# EAGLE design ZwiftCommand (EAGLE 9.3.0)
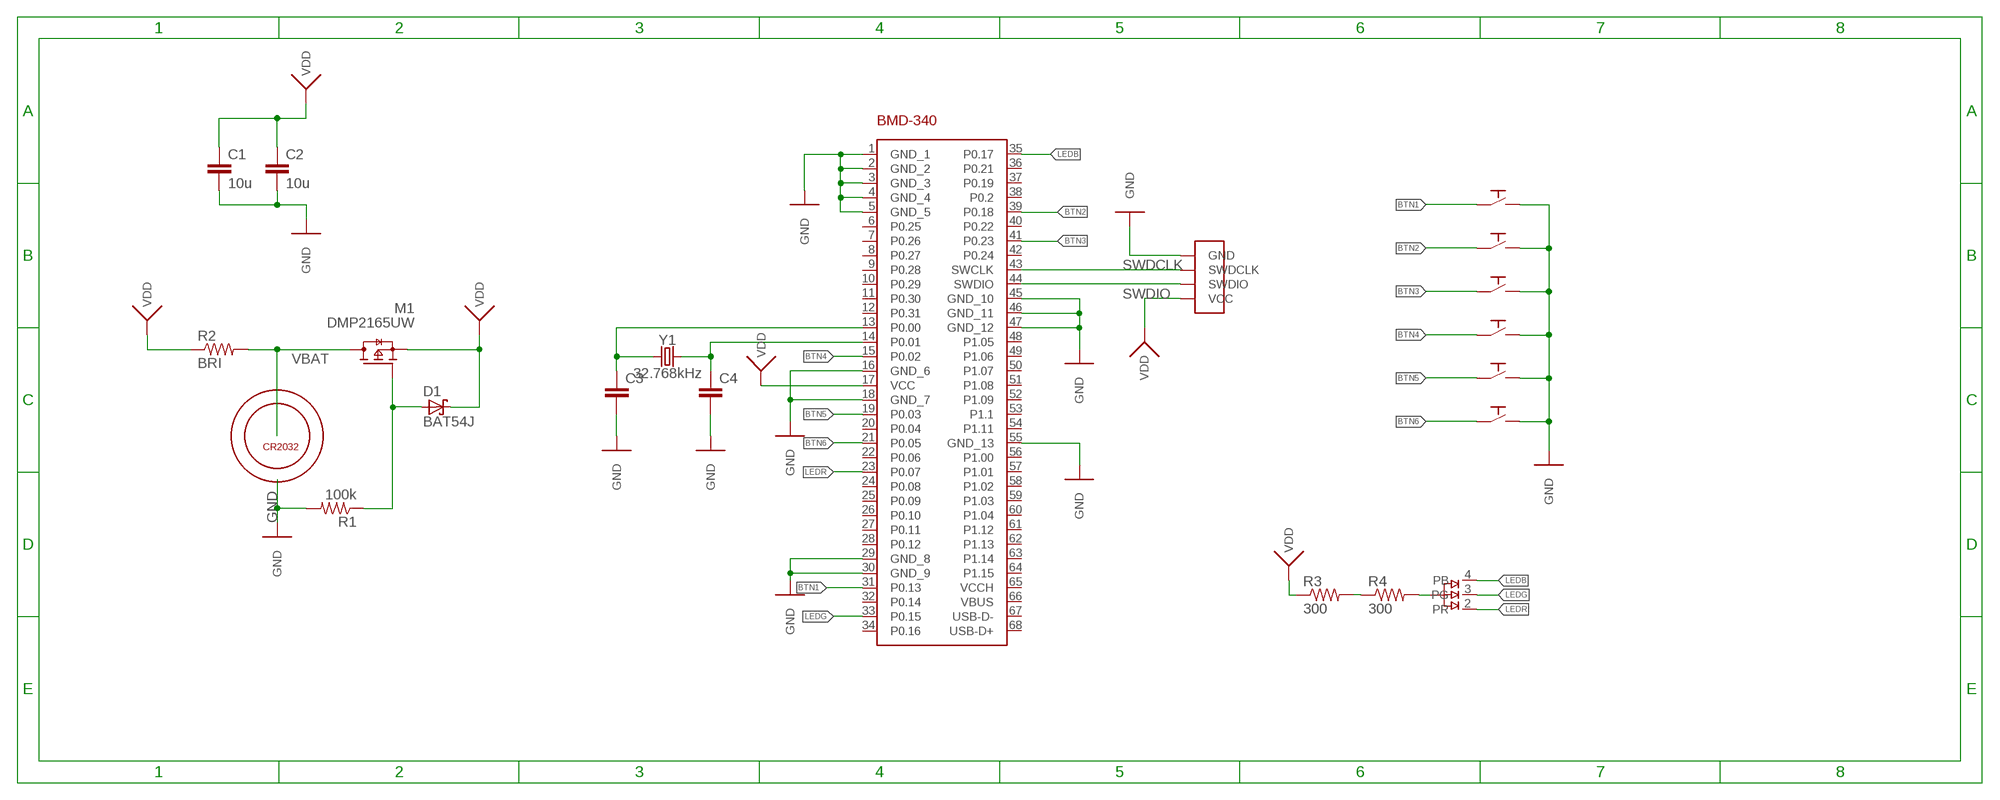
[diagram p0: schematic, sheet 1]

## Parts
C1  10u  C-EUC0603  [C0603]
C2  10u  C-EUC0603  [C0603]
C3  C-EUC0603  [C0603]
C4  C-EUC0603  [C0603]
D1  BAT54J  [SOD323(F)]
D2  LRTBR48G  [LRTBR48GP9Q71R7S526NP68]
IC1  BMD-340-A-R  [BMD340AR]
M1  DMP2165UW  [SOT65P210X110-3N]
R1  100k  R-US_R0603  [R0603]
R2  BRI  R-US_R0402  [R0402]
R3  300  R-US_R0603  [R0603]
R4  300  R-US_R0603  [R0603]
SPST1  PTS526SK08  [PTS526SKG15SMTR2LFS]
SPST2  PTS526SK08  [PTS526SKG15SMTR2LFS]
SPST3  PTS526SK08  [PTS526SKG15SMTR2LFS]
SPST4  PTS526SK08  [PTS526SKG15SMTR2LFS]
SPST5  PTS526SK08  [PTS526SKG15SMTR2LFS]
SPST6  PTS526SK08  [PTS526SKG15SMTR2LFS]
U1  BAT-HLD-001-THM  [BATHLD001THM]
U$2  PROG_SMD  [PROG_SMD]
Y1  32.768kHz  CRYSTAL-32.768KHZSMD-3.2X1.5  [CRYSTAL-SMD-3.2X1.5MM]

## Nets
BTN1: IC1.31(P0.13) SPST1.1 SPST1.2
BTN2: IC1.39(P0.18) SPST2.1 SPST2.2
BTN3: IC1.41(P0.23) SPST3.1 SPST3.2
BTN4: IC1.15(P0.02) SPST4.1 SPST4.2
BTN5: IC1.19(P0.03) SPST5.1 SPST5.2
BTN6: IC1.21(P0.05) SPST6.1 SPST6.2
GND: C1.2 C2.2 C3.2 C4.2 IC1.1(GND_1) IC1.2(GND_2) IC1.3(GND_3) IC1.4(GND_4) IC1.5(GND_5) IC1.16(GND_6) IC1.18(GND_7) IC1.29(GND_8) IC1.30(GND_9) IC1.45(GND_10) IC1.46(GND_11) IC1.47(GND_12) IC1.55(GND_13) R1.2 SPST1.3 SPST1.4 SPST2.3 SPST2.4 SPST3.3 SPST3.4 SPST4.3 SPST4.4 SPST5.3 SPST5.4 SPST6.3 SPST6.4 U1.5(-) U$2.GND
LEDB: D2.4(PB) IC1.35(P0.17)
LEDG: D2.3(PG) IC1.33(P0.15)
LEDR: D2.2(PR) IC1.23(P0.07)
N$1: C3.1 IC1.13(P0.00) Y1.P$1
N$2: D1.2(A) M1.1(G) R1.1
N$3: R3.2 R4.1
N$4: C4.1 IC1.14(P0.01) Y1.P$2
N$5: D2.1 R4.2
SWDCLK: IC1.43(SWCLK) U$2.PIN1(SWDCLK)
SWDIO: IC1.44(SWDIO) U$2.PIN2(SWDIO)
VBAT [power]: M1.3(D) R2.2 U1.1(+) U1.2(+) U1.3(+) U1.4(+)
VDD [power]: C1.1 C2.1 D1.1(K) IC1.17(VCC) M1.2(S) R2.1 R3.1 U$2.VCC
Unconnected: IC1.6(P0.25) IC1.7(P0.26) IC1.8(P0.27) IC1.9(P0.28) IC1.10(P0.29) IC1.11(P0.30) IC1.12(P0.31) IC1.20(P0.04) IC1.22(P0.06) IC1.24(P0.08) IC1.25(P0.09) IC1.26(P0.10) IC1.27(P0.11) IC1.28(P0.12) IC1.32(P0.14) IC1.34(P0.16) IC1.36(P0.21) IC1.37(P0.19) IC1.38(P0.2) IC1.40(P0.22) IC1.42(P0.24) IC1.48(P1.05) IC1.49(P1.06) IC1.50(P1.07) IC1.51(P1.08) IC1.52(P1.09) IC1.53(P1.1) IC1.54(P1.11) IC1.56(P1.00) IC1.57(P1.01) IC1.58(P1.02) IC1.59(P1.03) IC1.60(P1.04) IC1.61(P1.12) IC1.62(P1.13) IC1.63(P1.14) IC1.64(P1.15) IC1.65(VCCH) IC1.66(VBUS) IC1.67(USB-D-) IC1.68(USB-D+)

## Library data of the parts
C1-C4 = resistor:C-EU: CAPACITOR, European symbol
D1 = Diodes:BAT54: Schottky barrier diode Planar Schottky barrier diode encapsulated in small plastic SMD packages. Single diodes and double diodes with different pinning are available AAL Eindhoven MK
D2 = KPA_LED:LRTBR48G: RGB LED in a single package
IC1 = Rigado:BMD-340-A-R: Bluetooth Modules (802.15.1) BMD-340-A-R with nRF52840 processor Source: Datasheet <https://componentsearchengine.com/Datasheets/1/BMD-340-A-R.pdf>; DESCRIPTION: Bluetooth Modules (802.15.1) BMD-340-A-R with nRF52840 processor; HEIGHT: 4mm; MANUFACTURER_NAME: Rigado; MANUFACTURER_PART_NUMBER: BMD-340-A-R; MOUSER_PART_NUMBER: 377-BMD-340-A-R
M1 = MOSFET:DMP2165UW: This MOSFET is designed to minimize the on-state resistance (RDS(ON)) and yet maintain superior switching performance, making it ideal for high efficiency power management applications.
R1-R4 = resistor:R-US_: RESISTOR, American symbol
SPST1-SPST6 = SPST:PTS526SK08: Interrupteurs de contact 50mA 12VDC, 5.2x5.2mm, 0.8mm H, 260gf, G leads, No ground pin, no actuator; MTN: 611-PTS526SK08SMTR2L
U1 = BatteryHolder:BAT-HLD-001-THM: Coin Cell Battery Holders Bat Hld CR2032/2025 Through-hole Mount Source: Datasheet <https://componentsearchengine.com/Datasheets/1/BAT-HLD-001-THM.pdf>; DESCRIPTION: Coin Cell Battery Holders Bat Hld CR2032/2025 Through-hole Mount; HEIGHT: 4.2mm; MANUFACTURER_NAME: Linx Technologies; MANUFACTURER_PART_NUMBER: BAT-HLD-001-THM; MOUSER_PART_NUMBER: 712-BAT-HLD-001-THM; MOUSER_PRICE-STOCK: https://www.mouser.com/Search/Refine.aspx?Keyword=712-BAT-HLD-001-THM
U$2 = Prog:PROG_SMD
Y1 = SparkFun-Clocks:CRYSTAL-32.768KHZ: 32.768kHz Crystal Frequency: 32.768kHz Frequency Stability: ±20ppm Load Capacitance: 12.5pF (PTH-2X6 & SMD-3.2X1.5), 6pF (SMD-2X6) SparkFun Products: SparkFun BigTime Watch Kit <https://www.sparkfun.com/products/11734> SparkFun nRF52832 Breakout <https://www.sparkfun.com/products/13990> SparkFun Real Time Clock Module <https://www.sparkfun.com/products/12708>; PROD_ID: XTAL-13062

## Net classes
0 default: width 0.152 mm, drill 0.178 mm, clearance 0.178 mm
1 power: width 0.305 mm, drill 0.178 mm, clearance 0.254 mm

## Board
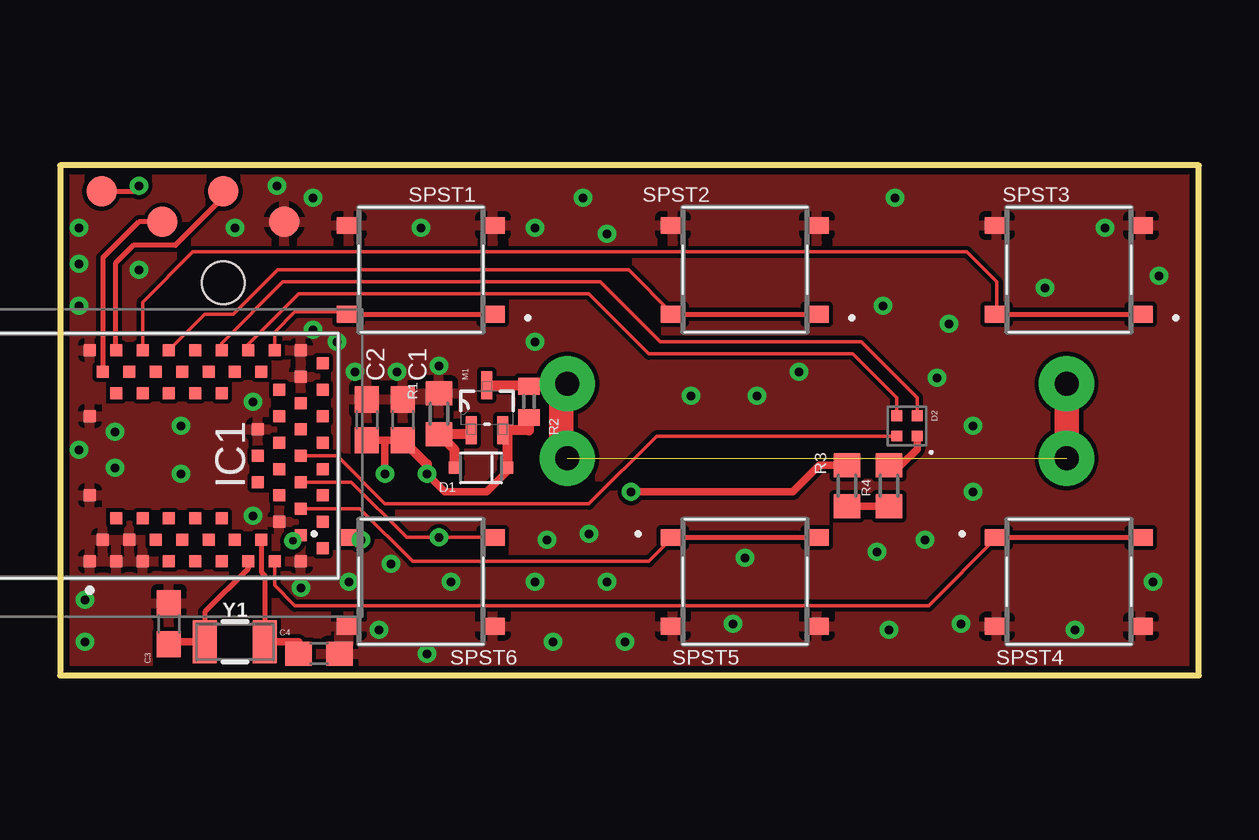
[diagram p1: board, top side]
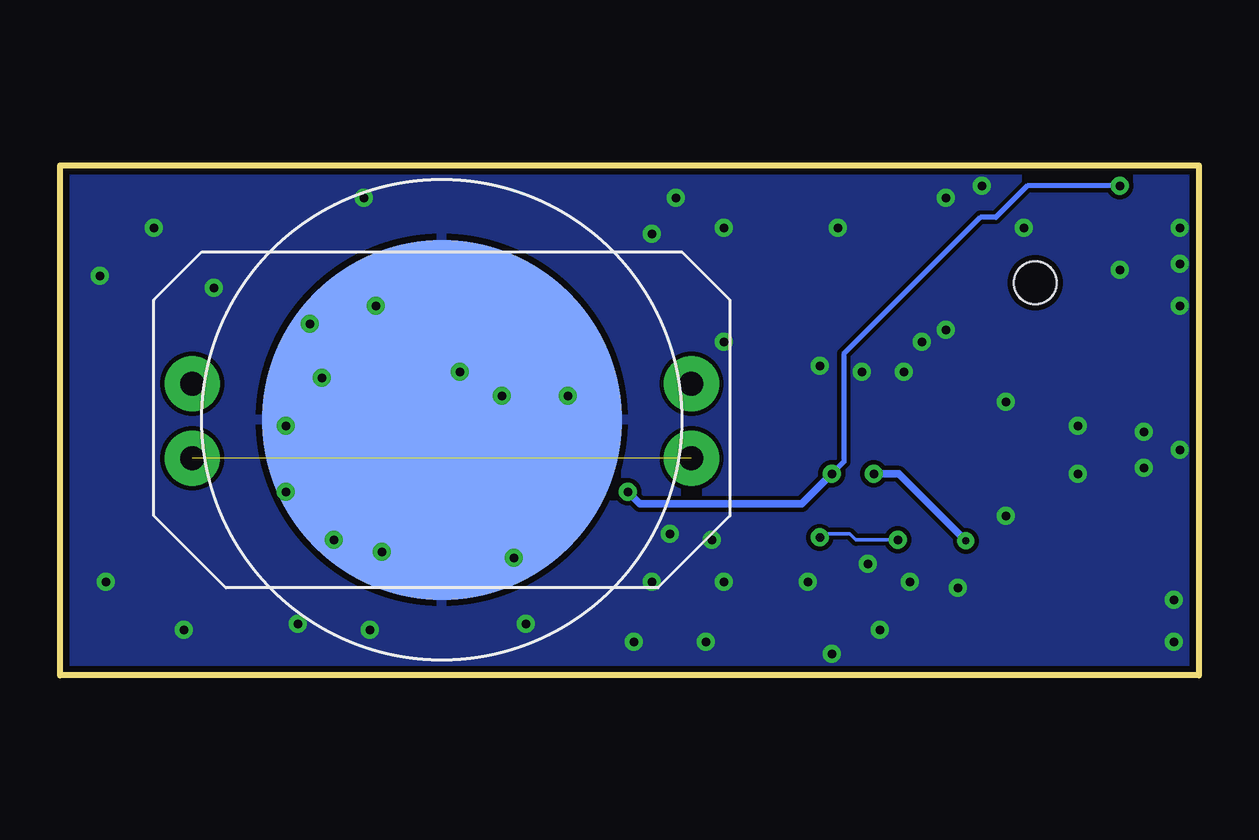
[diagram p2: board, bottom side, seen from below]

Size 47.45 x 21.25 mm. Coordinates in mm from the lower left corner, seen from the top.
Outline: 0,0 47.45,0 47.45,21.25 0,21.25 0,0
Copper layers (1*16): Top 0.035mm / dielectric 1.5mm / Bottom 0.035mm
Design rules "default *": minimum track width 6mil, minimum drill 0.35mm, track to track 6mil, track to pad 6mil, pad to pad 6mil, via to via 6mil, smd to smd 6mil, copper to edge 10mil, drill to drill 6mil, minimum pad ring 10mil, minimum via ring 8mil, stop-mask expansion 4mil, vias tented up to drill 0mil, thermal gap 10mil

### Footprints (pad centres in the part's own frame; a part is rotated, then mirrored left to right if it is on the bottom)
C0603 = smd 1.1 x 1: 1 -0.85,0; 2 0.85,0
SOD323(F) = smd 0.5 x 0.5: 1 1.1,0; 2 -1.1,0
LRTBR48GP9Q71R7S526NP68 = smd 0.45 x 0.45: 1 0.425,0.425; 2 0.425,-0.425; 3 -0.425,-0.425; 4 -0.425,0.425
BMD340AR = smd 0.5 x 0.5: 1 -8.8,-4.4; 2 -8.25,-3.5; 3 -7.7,-4.4; 4 -7.15,-3.5; 5 -6.6,-4.4; 6 -6.05,-3.5; 7 -5.5,-4.4; 8 -4.95,-3.5; 9 -4.4,-4.4; 10 -3.85,-3.5; 11 -3.3,-4.4; 12 -2.75,-3.5; 13 -2.2,-4.4; 14 -1.65,-3.5; 15 -1.1,-4.4; 16 0,-4.4; 17 0,-3.3; 18 -0.9,-2.75; 19 0,-2.2; 20 -0.9,-1.65; 21 0,-1.1; 22 -0.9,-0.55; 23 0,0; 24 -0.9,0.55; 25 0,1.1; 26 -0.9,1.65; 27 0,2.2; 28 -0.9,2.75; 29 0,3.3; 30 0,4.4; 31 -1.1,4.4; 32 -1.65,3.5; 33 -2.2,4.4; 34 -2.75,3.5; 35 -3.3,4.4; 36 -3.85,3.5; 37 -4.4,4.4; 38 -4.95,3.5; 39 -5.5,4.4; 40 -6.05,3.5; 41 -6.6,4.4; 42 -7.15,3.5; 43 -7.7,4.4; 44 -8.25,3.5; 45 -8.8,4.4; 46 -8.8,1.65; 47 -8.8,-1.65; 48 -7.7,-2.6; 49 -6.6,-2.6; 50 -5.5,-2.6; 51 -4.4,-2.6; 52 -3.3,-2.6; 53 -1.8,-1.1; 54 -1.8,0; 55 -1.8,1.1; 56 -3.3,2.6; 57 -4.4,2.6; 58 -5.5,2.6; 59 -6.6,2.6; 60 -7.7,2.6; 61 0.9,-3.85; 62 0.9,-2.75; 63 0.9,-1.65; 64 0.9,-0.55; 65 0.9,0.55; 66 0.9,1.65; 67 0.9,2.75; 68 0.9,3.85
SOT65P210X110-3N = smd 1.168 x 0.457: 1 -0.94,0.65; 2 -0.94,-0.65; 3 0.94,0
R0603 = smd 1 x 1.1: 1 -0.85,0; 2 0.85,0
R0402 = smd 0.7 x 0.9: 1 -0.65,0; 2 0.65,0
PTS526SKG15SMTR2LFS = smd 1 x 0.7: 1 -3,1.85; 2 3,1.85; 3 -3,-1.85; 4 3,-1.85
BATHLD001THM = drill 1 pad 2.3: 1 -10.4,1.5; 2 -10.4,-1.6; 3 10.4,-1.6; 4 10.4,1.5 | smd 15 x 15: 5 0,0
PROG_SMD = smd 1.27 x 1.27: GND 3.81,0; PIN1 1.27,1.27; PIN2 -1.27,0; VCC -3.81,1.27 | hole 1.778: 1.27,-2.54
CRYSTAL-SMD-3.2X1.5MM = smd 1 x 1.8: P$1 -1.25,0; P$2 1.25,0

### Placement (x,y rotation side)
C1  14.29,10.65 90 top
C2  12.79,10.65 90 top
C3  4.54,2.15 90 top
C4  10.79,0.9 0 top
D1  17.54,8.65 0 top
D2  35.29,10.4 270 top
IC1  10.04,9.15 0 top
M1  17.79,11.15 90 top
R1  15.79,10.9 90 top
R2  19.54,11.4 90 top
R3  32.79,7.9 270 top
R4  34.54,7.9 90 top
SPST1  15.04,16.9 180 top
SPST2  28.54,16.9 180 top
SPST3  42.04,16.9 180 top
SPST4  42.04,3.9 0 top
SPST5  28.54,3.9 0 top
SPST6  15.04,3.9 0 top
U1  31.54,10.65 0 bottom
U$2  5.54,18.9 0 top
Y1  7.29,1.4 0 top

### Tracks (layer width: path | path; a pad name or v marks a point on that pad's centre or on a via)
BTN1
  Top 0.152: IC1.31 8.94,14.3 9.79,15.15 11.94,15.15
  Top 0.203: SPST1.1 SPST1.2 11.94,15.15
BTN2
  Top 0.152: SPST2.2 23.69,16.9 9.08,16.9 7.22,15.04 6.03,15.04 IC1.39
  Top 0.203: SPST2.2 SPST2.1
BTN3
  Top 0.152: IC1.41 3.44,15.55 5.54,17.65 37.79,17.65 39.04,16.4 SPST3.2
  Top 0.203: SPST3.2 SPST3.1
BTN4
  Top 0.152: SPST4.1 36.19,2.9 9.79,2.9 8.94,3.75 IC1.15
  Top 0.203: SPST4.1 SPST4.2
BTN5
  Top 0.152: SPST5.1 24.54,4.75 14.69,4.75 12.49,6.95 IC1.19
  Top 0.203: SPST5.1 SPST5.2
BTN6  (via drill 0.35)
  Top 0.152: 11.64,5.75 SPST6.1 12.14,5.65 v12.54,5.65 | SPST6.2 v15.79,5.75 14.44,5.75 12.14,8.05 IC1.21
  Bottom 0.152: v12.54,5.65 14.29,5.65 14.54,5.9 15.64,5.9 v15.79,5.75
GND  (via drill 0.35)
  other vias: 12.29,12.65 15.79,12.9 14.04,12.65 19.79,13.9 21.79,19.9 19.79,18.65 22.79,18.4 10.54,19.9 43.54,18.65 41.04,16.15 45.79,16.65 45.54,3.9 42.29,1.9 37.54,2.15 34.54,1.9 28.04,2.15 28.54,4.9 20.54,1.4 23.54,1.4 22.79,3.9 12.04,3.9 13.29,1.9 1.04,3.15 1.04,1.4 9.04,20.4 7.29,18.65 0.79,17.15 0.79,15.4 0.79,18.65 30.79,12.65 37.04,14.65 38.04,10.4 38.04,7.65 36.54,12.4 34.29,15.4 34.04,5.15 36.04,5.65 34.79,19.9 2.29,10.15 2.29,8.65 0.79,9.4 10.04,3.65 8.04,6.65 8.04,11.4 11.54,13.9 15.04,18.65 10.54,14.4 3.29,16.9 5.04,8.4 5.04,10.4 16.29,3.9 13.79,4.65 19.79,3.9 20.29,5.65 22.04,5.9 15.29,0.9 26.29,11.65 29.04,11.65
  pour Top (rank 6): 5.54,26.9 0.29,21.65 0.29,-1.1 2.79,-3.6 48.79,-3.6 53.04,0.65 53.04,25.4 51.54,26.9
  pour Bottom (rank 6): 5.79,26.15 0.29,20.65 0.29,-1.85 2.79,-4.35 48.79,-4.35 53.04,-0.1 53.04,24.65 51.54,26.15
LEDB
  Top 0.152: D2.4 35.72,11.58 33.39,13.9 25.02,13.9 22.52,16.4 9.29,16.4 6.74,13.85 IC1.35
LEDG
  Top 0.152: D2.3 34.86,11.58 33.04,13.4 24.54,13.4 22.04,15.9 9.94,15.9 7.84,13.8 IC1.33
LEDR
  Top 0.152: D2.2 24.86,9.97 22.04,7.15 13.54,7.15 11.54,9.14 10.06,9.14 10.06,9.15 IC1.23
N$1
  Top 0.203: IC1.13 7.84,4.45 6.04,2.65 Y1.P$1
  Top 0.305: Y1.P$1 4.64,1.4 C3.1
N$2
  Top 0.406: D1.2 16.44,9.4 R1.1 16.98,10.05 M1.1
N$3
  Top 0.305: R4.1 R3.2
N$4
  Top 0.203: IC1.14 8.39,4.3 8.54,4.15 Y1.P$2
  Top 0.305: Y1.P$2 9.94,1.4 C4.1
N$5
  Top 0.305: D2.1 35.72,9.43 35.04,8.75 R4.2
SWDCLK
  Top 0.203: IC1.43 2.31,13.58 2.31,17.17 3.06,17.92 4.81,17.92 6.81,19.92 U$2.PIN1
SWDIO
  Top 0.152: U$2.PIN2 4.04,18.9 3.79,19.15
  Top 0.203: IC1.44 1.79,17.4 3.29,18.9 U$2.PIN2
VBAT  (1 unrouted)
  Top 0.406: M1.3 19.5,12.09 R2.2 21.04,12.05 U1.4
  Top 1.016: U1.4 20.89,11.9 20.89,9.3 U1.3 | U1.1 U1.2
VDD  (via drill 0.3, 0.35)
  Top 0.203: U$2.VCC 3.06,20.17 v3.29,20.4
  Top 0.305: 12.69,9.7 C2.1 13.54,9.8 | 13.54,9.8 C1.1 | v23.79,7.65 30.54,7.65 31.64,8.75 R3.1 | IC1.17 9.8,5.61 v9.7,5.61 | v13.54,8.4 13.54,9.8 | D1.1 18.64,8.5 17.79,7.65 16.04,7.65 v15.29,8.4
  Top 0.406: D1.1 18.64,10.01 M1.2 19.54,10.21 R2.1 | v15.29,8.4 15.29,8.8 C1.1
  Bottom 0.203: v3.29,20.4 7.14,20.4 8.45,19.09 9.1,19.09 14.79,13.4 14.79,8.9 v15.29,8.4
  Bottom 0.305: v23.79,7.65 23.29,7.15 16.54,7.15 v15.29,8.4 | v9.7,5.61 12.5,8.4 v13.54,8.4